# Altium schematic sheet HEADER_2.SchDoc
size 420 x 297 mm; SheetNumber: 3; SheetTotal: 12
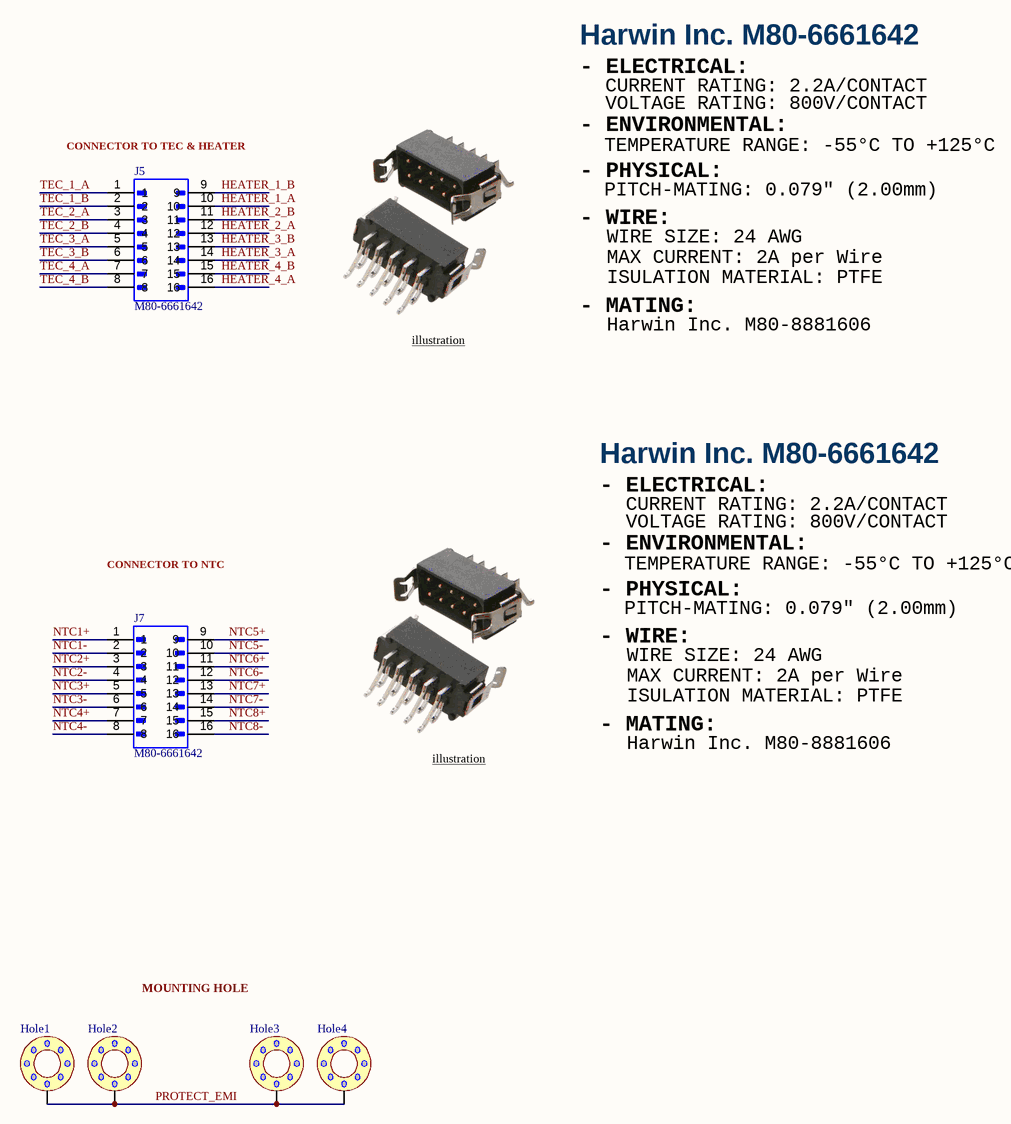
[diagram p0: HEADER_2.SchDoc]

## Parts
Hole1  hole_space  [HOLE_SPACE]  (value not drawn)
Hole2  hole_space  [HOLE_SPACE]  (value not drawn)
Hole3  hole_space  [HOLE_SPACE]  (value not drawn)
Hole4  hole_space  [HOLE_SPACE]  (value not drawn)
J5  M80-6661642  [M80-6661642]
J7  M80-6661642  [M80-6661642]

## Nets
HEATER_1_A: J5.10
HEATER_1_B: J5.9
HEATER_2_A: J5.12
HEATER_2_B: J5.11
HEATER_3_A: J5.14
HEATER_3_B: J5.13
HEATER_4_A: J5.16
HEATER_4_B: J5.15
NTC1+: J7.1
NTC1-: J7.2
NTC2+: J7.3
NTC2-: J7.4
NTC3+: J7.5
NTC3-: J7.6
NTC4+: J7.7
NTC4-: J7.8
NTC5+: J7.9
NTC5-: J7.10
NTC6+: J7.11
NTC6-: J7.12
NTC7+: J7.13
NTC7-: J7.14
NTC8+: J7.15
NTC8-: J7.16
PROTECT_EMI: Hole1.1 Hole2.1 Hole3.1 Hole4.1
TEC_1_A: J5.1
TEC_1_B: J5.2
TEC_2_A: J5.3
TEC_2_B: J5.4
TEC_3_A: J5.5
TEC_3_B: J5.6
TEC_4_A: J5.7
TEC_4_B: J5.8

## Notes on the sheet
- Harwin Inc. M80-6661642
- - ELECTRICAL:
- CURRENT RATING: 2.2A/CONTACT
- VOLTAGE RATING: 800V/CONTACT
- (near J5) CONNECTOR TO TEC & HEATER
- - ENVIRONMENTAL:
- - PHYSICAL:
- TEMPERATURE RANGE: -55°C TO +125°C
- - WIRE:
- PITCH-MATING: 0.079" (2.00mm)
- WIRE SIZE: 24 AWG
- - MATING:
- MAX CURRENT: 2A per Wire
- ISULATION MATERIAL: PTFE
- illustration
- Harwin Inc. M80-8881606
- CONNECTOR TO NTC
- Labels drawn without touching a wire or pin: MOUNTING HOLE
- Project:
- BEE-PC1
- Sub-system:
- NANORACK_EXP_CONTROLLER
- Design by:
- SANG HUYNH
- BAO BUI Q.
- Sheet title:
- Sheet
- A3
- of
- Checked by:
- Approved by:
- VU PHAM
- Revision:
- Document No:
- V1.1.0
- Size:
- Date:

## Library data of the parts
J5 J7 = CONN_SMD_16: CONN HEADER SMD R/A 16POS 2MM